# EAGLE schematic power-v3 (EAGLE 5.11)
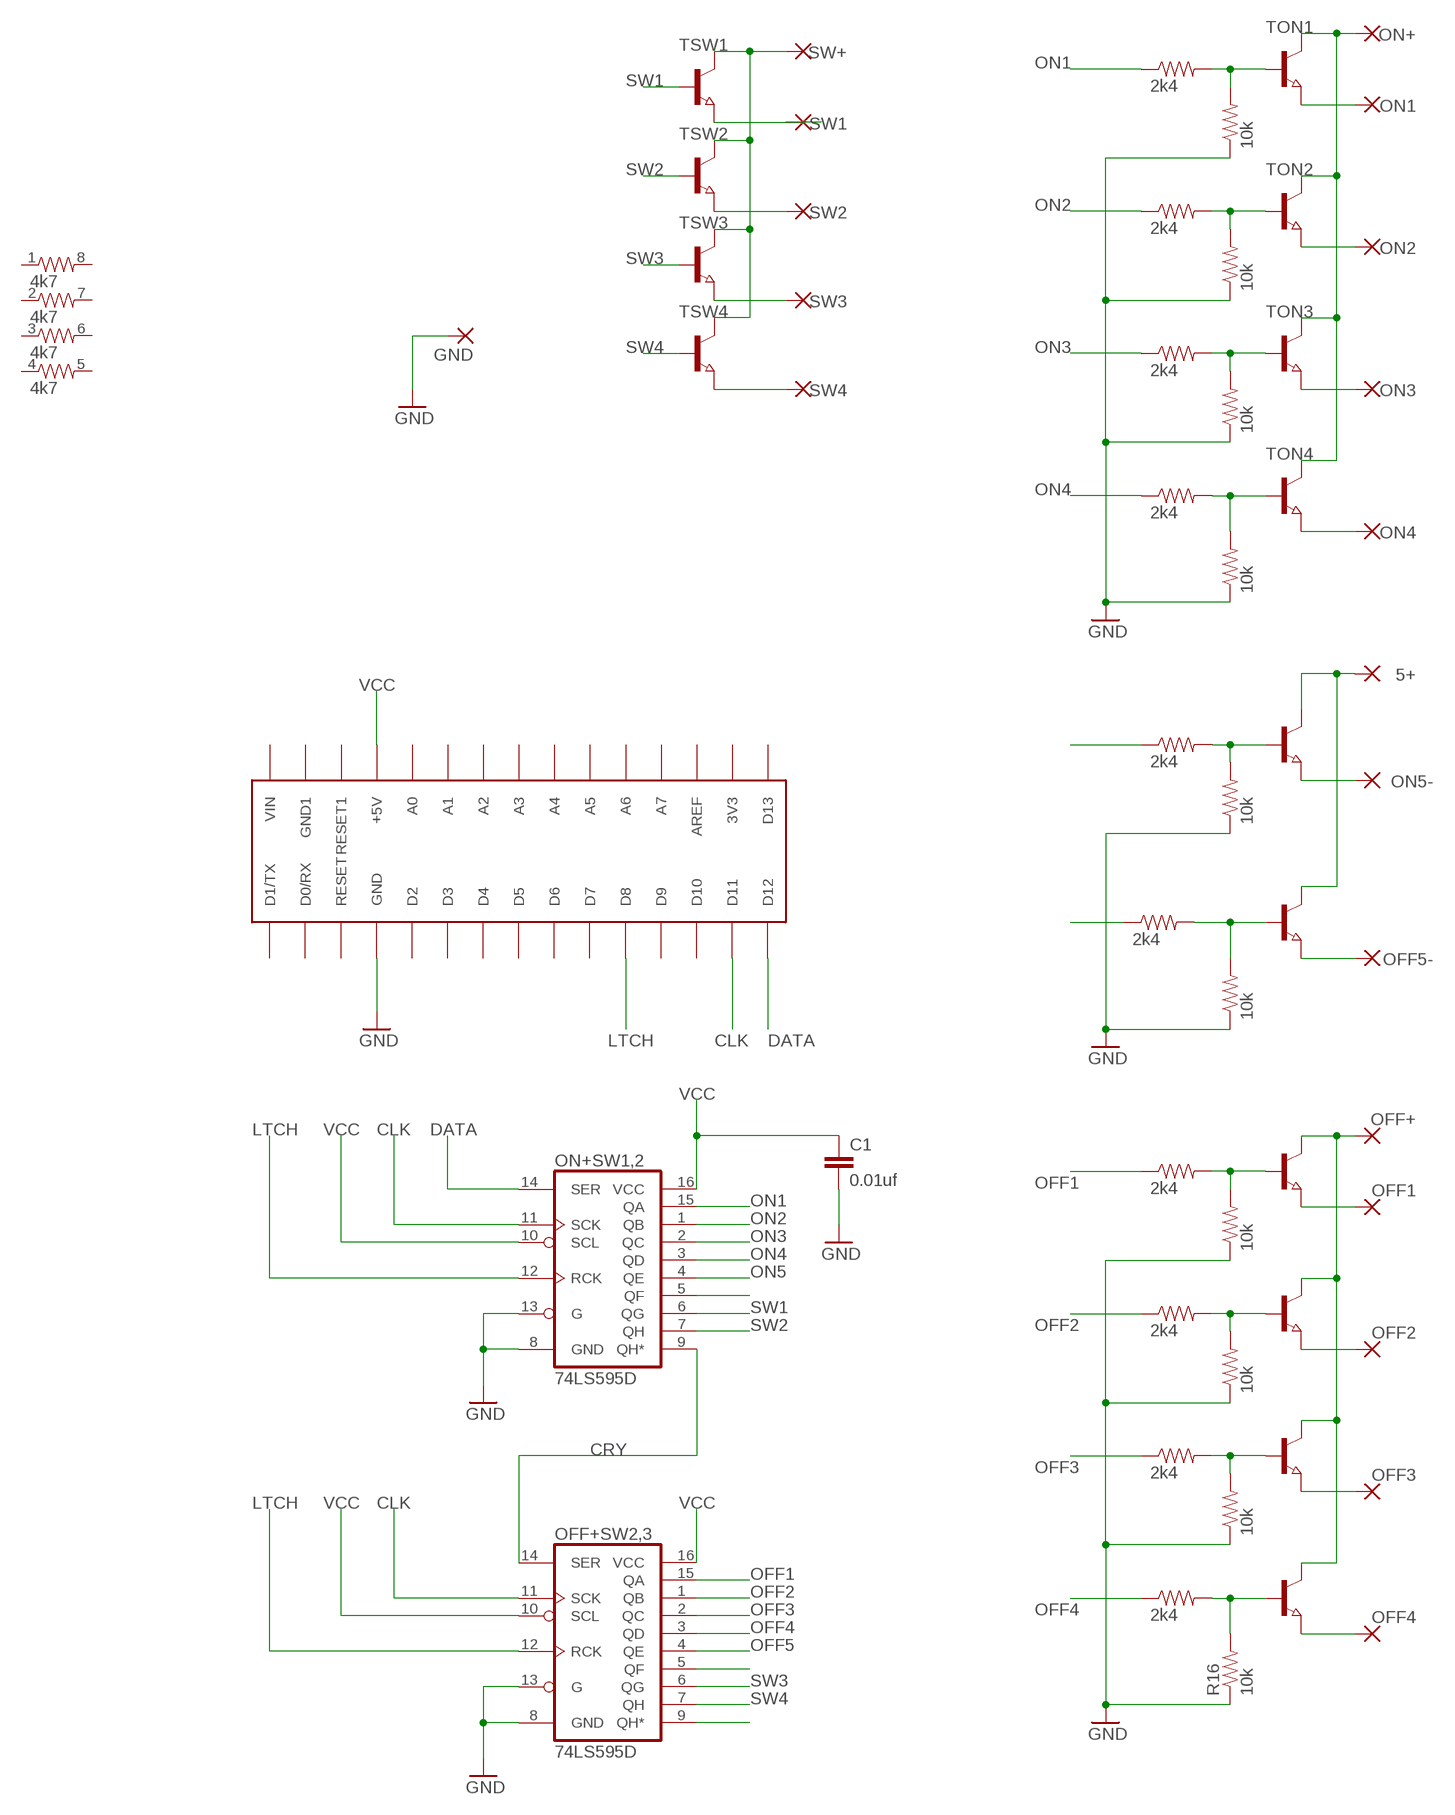
[diagram p0: schematic, sheet 1]

## Parts
5+  1,6/0,8  [1,6/0,8]
C1  0.01uf  CAP0603-CAP  [0603-CAP]
GND  1,6/0,8  [1,6/0,8]
NANO  ARDUINONANO  [PDIP-32]
OFF1  1,6/0,8  [1,6/0,8]
OFF2  1,6/0,8  [1,6/0,8]
OFF3  1,6/0,8  [1,6/0,8]
OFF4  1,6/0,8  [1,6/0,8]
OFF5-  1,6/0,8  [1,6/0,8]
OFF+  1,6/0,8  [1,6/0,8]
OFF+SW2,3  74LS595D  [SO16]
ON1  1,6/0,8  [1,6/0,8]
ON2  1,6/0,8  [1,6/0,8]
ON3  1,6/0,8  [1,6/0,8]
ON4  1,6/0,8  [1,6/0,8]
ON5-  1,6/0,8  [1,6/0,8]
ON+  1,6/0,8  [1,6/0,8]
ON+SW1,2  74LS595D  [SO16]
R1  2k4  RESISTOR0603-RES  [0603-RES]
R2  2k4  RESISTOR0603-RES  [0603-RES]
R3  2k4  RESISTOR0603-RES  [0603-RES]
R4  2k4  RESISTOR0603-RES  [0603-RES]
R5  10k  RESISTOR0603-RES  [0603-RES]
R6  10k  RESISTOR0603-RES  [0603-RES]
R7  10k  RESISTOR0603-RES  [0603-RES]
R8  10k  RESISTOR0603-RES  [0603-RES]
R9  2k4  RESISTOR0603-RES  [0603-RES]
R10  2k4  RESISTOR0603-RES  [0603-RES]
R11  2k4  RESISTOR0603-RES  [0603-RES]
R12  2k4  RESISTOR0603-RES  [0603-RES]
R13  10k  RESISTOR0603-RES  [0603-RES]
R14  10k  RESISTOR0603-RES  [0603-RES]
R15  10k  RESISTOR0603-RES  [0603-RES]
R16  10k  RESISTOR0603-RES  [0603-RES]
R17  2k4  RESISTOR0603-RES  [0603-RES]
R18  2k4  RESISTOR0603-RES  [0603-RES]
R19  10k  RESISTOR0603-RES  [0603-RES]
R20  10k  RESISTOR0603-RES  [0603-RES]
R21  4k7  RESISTOR-ARRAY0603-ARV  [0603-ARV]
SW1  1,6/0,8  [1,6/0,8]
SW2  1,6/0,8  [1,6/0,8]
SW3  1,6/0,8  [1,6/0,8]
SW4  1,6/0,8  [1,6/0,8]
SW+  1,6/0,8  [1,6/0,8]
TOFF2  NPN-TRANSISTOR_SOT23  [SOT23]
TOFF3  NPN-TRANSISTOR_SOT23  [SOT23]
TOFF4  NPN-TRANSISTOR_SOT23  [SOT23]
TOFF5  NPN-TRANSISTOR_SOT23  [SOT23]
TON1  NPN-TRANSISTOR_SOT23  [SOT23]
TON2  NPN-TRANSISTOR_SOT23  [SOT23]
TON3  NPN-TRANSISTOR_SOT23  [SOT23]
TON4  NPN-TRANSISTOR_SOT23  [SOT23]
TON5  NPN-TRANSISTOR_SOT23  [SOT23]
TON7  NPN-TRANSISTOR_SOT23  [SOT23]
TSW1  NPN-TRANSISTOR_SOT23  [SOT23]
TSW2  NPN-TRANSISTOR_SOT23  [SOT23]
TSW3  NPN-TRANSISTOR_SOT23  [SOT23]
TSW4  NPN-TRANSISTOR_SOT23  [SOT23]

## Nets
CLK: NANO.D11 OFF+SW2,3.11(SCK) ON+SW1,2.11(SCK)
CRY: OFF+SW2,3.14(SER) ON+SW1,2.9(QH*)
DATA: NANO.D12 ON+SW1,2.14(SER)
GND: C1.2 GND.1(P) NANO.GND OFF+SW2,3.8(GND) OFF+SW2,3.13(G) ON+SW1,2.8(GND) ON+SW1,2.13(G) R5.1 R6.1 R7.1 R8.1 R13.1 R14.1 R15.1 R16.1 R19.1 R20.1
LTCH: NANO.D8 OFF+SW2,3.12(RCK) ON+SW1,2.12(RCK)
N$1: ON+.1(P) TON1.3(C) TON2.3(C) TON3.3(C) TON4.3(C)
N$2: ON4.1(P) TON4.2(E)
N$3: ON3.1(P) TON3.2(E)
N$4: ON2.1(P) TON2.2(E)
N$5: 5+.1(P) TOFF5.3(C) TON5.3(C)
N$6: ON1.1(P) TON1.2(E)
N$7: SW+.1(P) TSW1.3(C) TSW2.3(C) TSW3.3(C) TSW4.3(C)
N$8: SW1.1(P) TSW1.2(E)
N$9: SW2.1(P) TSW2.2(E)
N$10: SW3.1(P) TSW3.2(E)
N$11: ON5-.1(P) TON5.2(E)
N$12: SW4.1(P) TSW4.2(E)
N$13: R1.2 R5.2 TON1.1(B)
N$14: R3.2 R7.2 TON3.1(B)
N$15: R4.2 R8.2 TON4.1(B)
N$16: R17.1
N$17: OFF1.1(P) TON7.2(E)
N$18: OFF4.1(P) TOFF4.2(E)
N$19: OFF3.1(P) TOFF3.2(E)
N$20: OFF2.1(P) TOFF2.2(E)
N$21: R18.1
N$26: R9.2 R13.2 TON7.1(B)
N$27: R11.2 R15.2 TOFF3.1(B)
N$28: R12.2 R16.2 TOFF4.1(B)
N$31: OFF5-.1(P) TOFF5.2(E)
N$38: ON+SW1,2.5(QF)
N$46: OFF+SW2,3.5(QF)
N$49: OFF+SW2,3.9(QH*)
OFF1: OFF+SW2,3.15(QA) R9.1
OFF2: OFF+SW2,3.1(QB) R10.1
OFF3: OFF+SW2,3.2(QC) R11.1
OFF4: OFF+SW2,3.3(QD) R12.1
OFF5: OFF+SW2,3.4(QE) R18.2 R20.2 TOFF5.1(B)
ON1: ON+SW1,2.15(QA) R1.1
ON2: ON+SW1,2.1(QB) R2.1 R2.2 R6.2 R10.2 R14.2 TOFF2.1(B) TON2.1(B)
ON3: ON+SW1,2.2(QC) R3.1
ON4: ON+SW1,2.3(QD) R4.1
ON5: ON+SW1,2.4(QE) R17.2 R19.2 TON5.1(B)
SW1: ON+SW1,2.6(QG) TSW1.1(B)
SW2: ON+SW1,2.7(QH) TSW2.1(B)
SW3: OFF+SW2,3.6(QG) TSW3.1(B)
SW4: OFF+SW2,3.7(QH) TSW4.1(B)
TOFF3: OFF+.1(P) TOFF2.3(C) TOFF3.3(C) TOFF4.3(C) TON7.3(C)
VCC: C1.1 NANO.+5V OFF+SW2,3.10(SCL) OFF+SW2,3.16(VCC) ON+SW1,2.10(SCL) ON+SW1,2.16(VCC)
Unconnected: NANO.3V3 NANO.A0 NANO.A1 NANO.A2 NANO.A3 NANO.A4 NANO.A5 NANO.A6 NANO.A7 NANO.AREF NANO.D0/RX NANO.D1/TX NANO.D2 NANO.D3 NANO.D4 NANO.D5 NANO.D6 NANO.D7 NANO.D9 NANO.D10 NANO.D13 NANO.GND1 NANO.RESET NANO.RESET1 NANO.VIN R21.1 R21.2 R21.3 R21.4 R21.5 R21.6 R21.7 R21.8

## Library data of the parts
5+ GND OFF1-OFF4 OFF5- OFF+ ON1-ON4 ON5- ON+ SW1-SW4 SW+ = wirepad:1,6/0,8: THROUGH-HOLE PAD
C1 = SparkFun:CAP: Capacitor Standard 0603 ceramic capacitor, and 0.1" leaded capacitor.
NANO = MyNano:ARDUINONANO
OFF+SW2,3 ON+SW1,2 = SparkFun:74*595: 8-bit SHIFT REGISTER, output latch
R1-R20 = SparkFun:RESISTOR: Resistor Basic schematic elements and footprints for 0603, 1206, and PTH resistors.
R21 = SparkFun:RESISTOR-ARRAY: Array Chip Resistor Source: RS Component / Phycomp
TOFF2-TOFF5 TON1-TON5 TON7 TSW1-TSW4 = semicon-smd-ipc:NPN-TRANSISTOR_: NPN TRANSISTOR

## Net classes
0 default: width 0.305 mm, clearance 0.305 mm